# Altium schematic sheet Power_supply.SchDoc
size A4; Organization: Altium Limited; Address1: L3, 12a Rodborough Rd; Address2: Frenchs Forest; Address3: NSW; Address4: Australia 2086
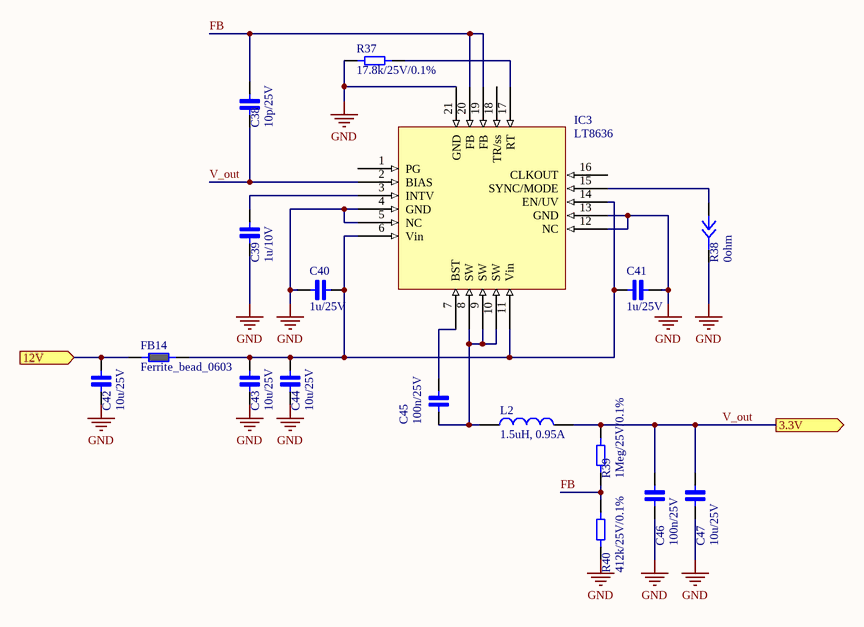
[diagram p0: Power_supply.SchDoc]

## Parts
C38  10p/25V  [CAP_0603]
C39  1u/10V  [CAP_0603]
C40  1u/25V  [CAP_0603]
C41  1u/25V  [CAP_0603]
C42  10u/25V  [CAP_1210]
C43  10u/25V  [CAP_1210]
C44  10u/25V  [CAP_1210]
C45  100n/25V  [CAP_0603]
C46  100n/25V  [CAP_0603]
C47  10u/25V  [CAP_1210]
FB14  Ferrite_bead_0603  [Ferrite_0603]
IC3  LT8636  [LQFN20]
L2  1.5uH, 0.95A  [WE-MAPI_1610]
R37  17.8k/25V/0.1%  [RES_0603]
R38  0ohm
R39  1Meg/25V/0.1%  [RES_0603]
R40  412k/25V/0.1%  [RES_0603]

## Ports
3.3V (out), 12V (in)

## Nets
GND: C39.2 C40.2 C41.2 C42.2 C43.2 C44.2 C46.2 C47.2 IC3.4(GND) IC3.5(NC) IC3.12(NC) IC3.13(GND) IC3.21(GND) R37.2 R38.2 R40.2
12V: C42.2 FB14.2 ; port 12V
FB: C38.2 IC3.19(FB) IC3.20(FB) R39.2 R40.2
V_out: C38.2 C46.2 C47.2 IC3.2(BIAS) L2.2 R39.2 ; port 3.3V
NetC39_2: C39.2 IC3.3(INTV)
NetC40_2: C40.2 C41.2 C43.2 C44.2 FB14.2 IC3.6(Vin) IC3.11(Vin) IC3.14(EN/UV)
NetC45_2: C45.2 IC3.7(BST)
NetC45_2: C45.2 IC3.8(SW) IC3.9(SW) IC3.10(SW) L2.1  [a separate net that carries the same name]
NetIC3_15: IC3.15(SYNC/MODE) R38.2
NetIC3_17: IC3.17(RT) R37.2

Not connected (* = marked no-connect by the designer): IC3 1(PG) 16(CLKOUT) 18(TR/ss)

## Notes on the sheet
- Title
- Size:
- Date:
- A4
- Number:
- Time:
- Revision:
- Sheet
- of
- File:

## Library data of the parts
C38 = Cap_0603_10p: Ceramic Capacitor 10p / 0603 / 25V / ±5%, Wurth Elektronik MLCC; ComponentLink1Description: New link; ComponentLink1URL: https://www.we-online.com/catalog/en/WCAP-CSGP-25VDC
C39 = Cap_0603_1u: Ceramic Capacitor 1uF / 0603 / 10V / ±5%, Wurth Elektronik MLCC
C40 C41 = Cap_0603_1u_25v: Ceramic Capacitor 1uF / 0603 / 25V / ±5%, Wurth Elektronik MLCC
C42-C44 C47 = Cap_1210_10u: Multilayer Ceramic Capacitors MLCC - SMD/SMT 1210 10uF 25volts *Derate Voltage/Temp; Manufacturer: Murata; Manufacturer Part Number: GRM32ER71K475KE14L; Voltage Rating (DC): 80V; Dielectric: X7R; Tolerance: 10%; Capacitance: 4.7uF; Supplier 1: Digi-Key; RoHS: Yes; Category: Ceramic Capacitors; Stock 1: 275397; Pricing 1: 1=1.05000, 10=0.79900, 50=0.66340, 100=0.57130, 500=0.44234 (USD); Mount: Surface Mount; Case/Package: 1210; Weight: 0.00388oz; Dielectric Material: Ceramic; Case Code (Metric): 3225; Case Code (Imperial): 1210; Min Operating Temperature: -55°C; Max Operating Temperature: 125°C; Package Quantity: 1000; Packaging: Tape and Reel; Voltage Rating: 80V; Voltage: 80V; Termination: SMD/SMT; Length: 3.2mm; Width: 2.5mm; Height: 2.5mm; Thickness: 0.106inch; Depth: 2.5mm; Lead Free: Lead Free; ComponentLink1URL: http://www.mouser.com/ds/2/281/c02e-2905.pdf?src-supplier=Mouser; ComponentLink1Description: http://www.mouser.com/ds/2/281/c02e-2905.pdf?src-supplier=Mouser; ComponentLink2URL: http://search.murata.co.jp/Ceramy/image/img/A01X/G101/ENG/GRM32ER71K475KE14-01.pdf?src-supplier=Digi-Key; ComponentLink2Description: http://search.murata.co.jp/Ceramy/image/img/A01X/G101/ENG/GRM32ER71K475KE14-01.pdf?src-supplier=Digi-Key
C45 C46 = Cap_0603_100n: Ceramic Capacitor 100n / 0603 / 25V / ±5%, Wurth Elektronik MLCC; ComponentLink1Description: New link; ComponentLink1URL: https://www.we-online.com/catalog/en/WCAP-CSGP-25VDC
FB14 = Ferrite_bead_0603: Ferrite bead
IC3 = LT8636: 42V, 5A/7A Peak Synchronous Step-Down / Silent Switcher with 2.5µA Quiescent Current
L2 = 74438313015: WE-MAPI SMT Power Inductor, size 1610, 1.5uH, 0.95A; Manufacturer: Wurth Elektronik; DC Resistance typ.: 189mOhm; DC Resistance max.: 237mOhm; Self Resonant Frequency: 90MHz; Saturation Current: 2.7A; ComponentLink1Description: Manufacturer; ComponentLink1URL: http://www.we-online.de; ComponentLink2Description: Datasheet; ComponentLink2URL: https://www.we-online.com/catalog/datasheet/74438313015.pdf; Mounting Technology: SMT; Operating Temperature: -40 to +125degC; Packaging: Tape and Reel; Published Date: April 2020; Size: 1610; Inductance: 1.5uH; Manufacturer Part Number: 74438313015; Rated Current: 0.95A
R37 = Res_0603_17.8k: Vishay, thin film resistor 17.8k/25V/0.1%
R38 = Jumper
R39 = Res_0603_1Meg: Vishay, thin film resistor 1Meg/25V/0.1%
R40 = Res_0603_412k: Vishay, thin film resistor 412k/25V/0.1%